# Altium schematic sheet UVLO_MODULE_TOP.SchDoc
size Tabloid; SheetNumber: 2; SheetTotal: 3; Sheet_Name: Top; Size: 11x17
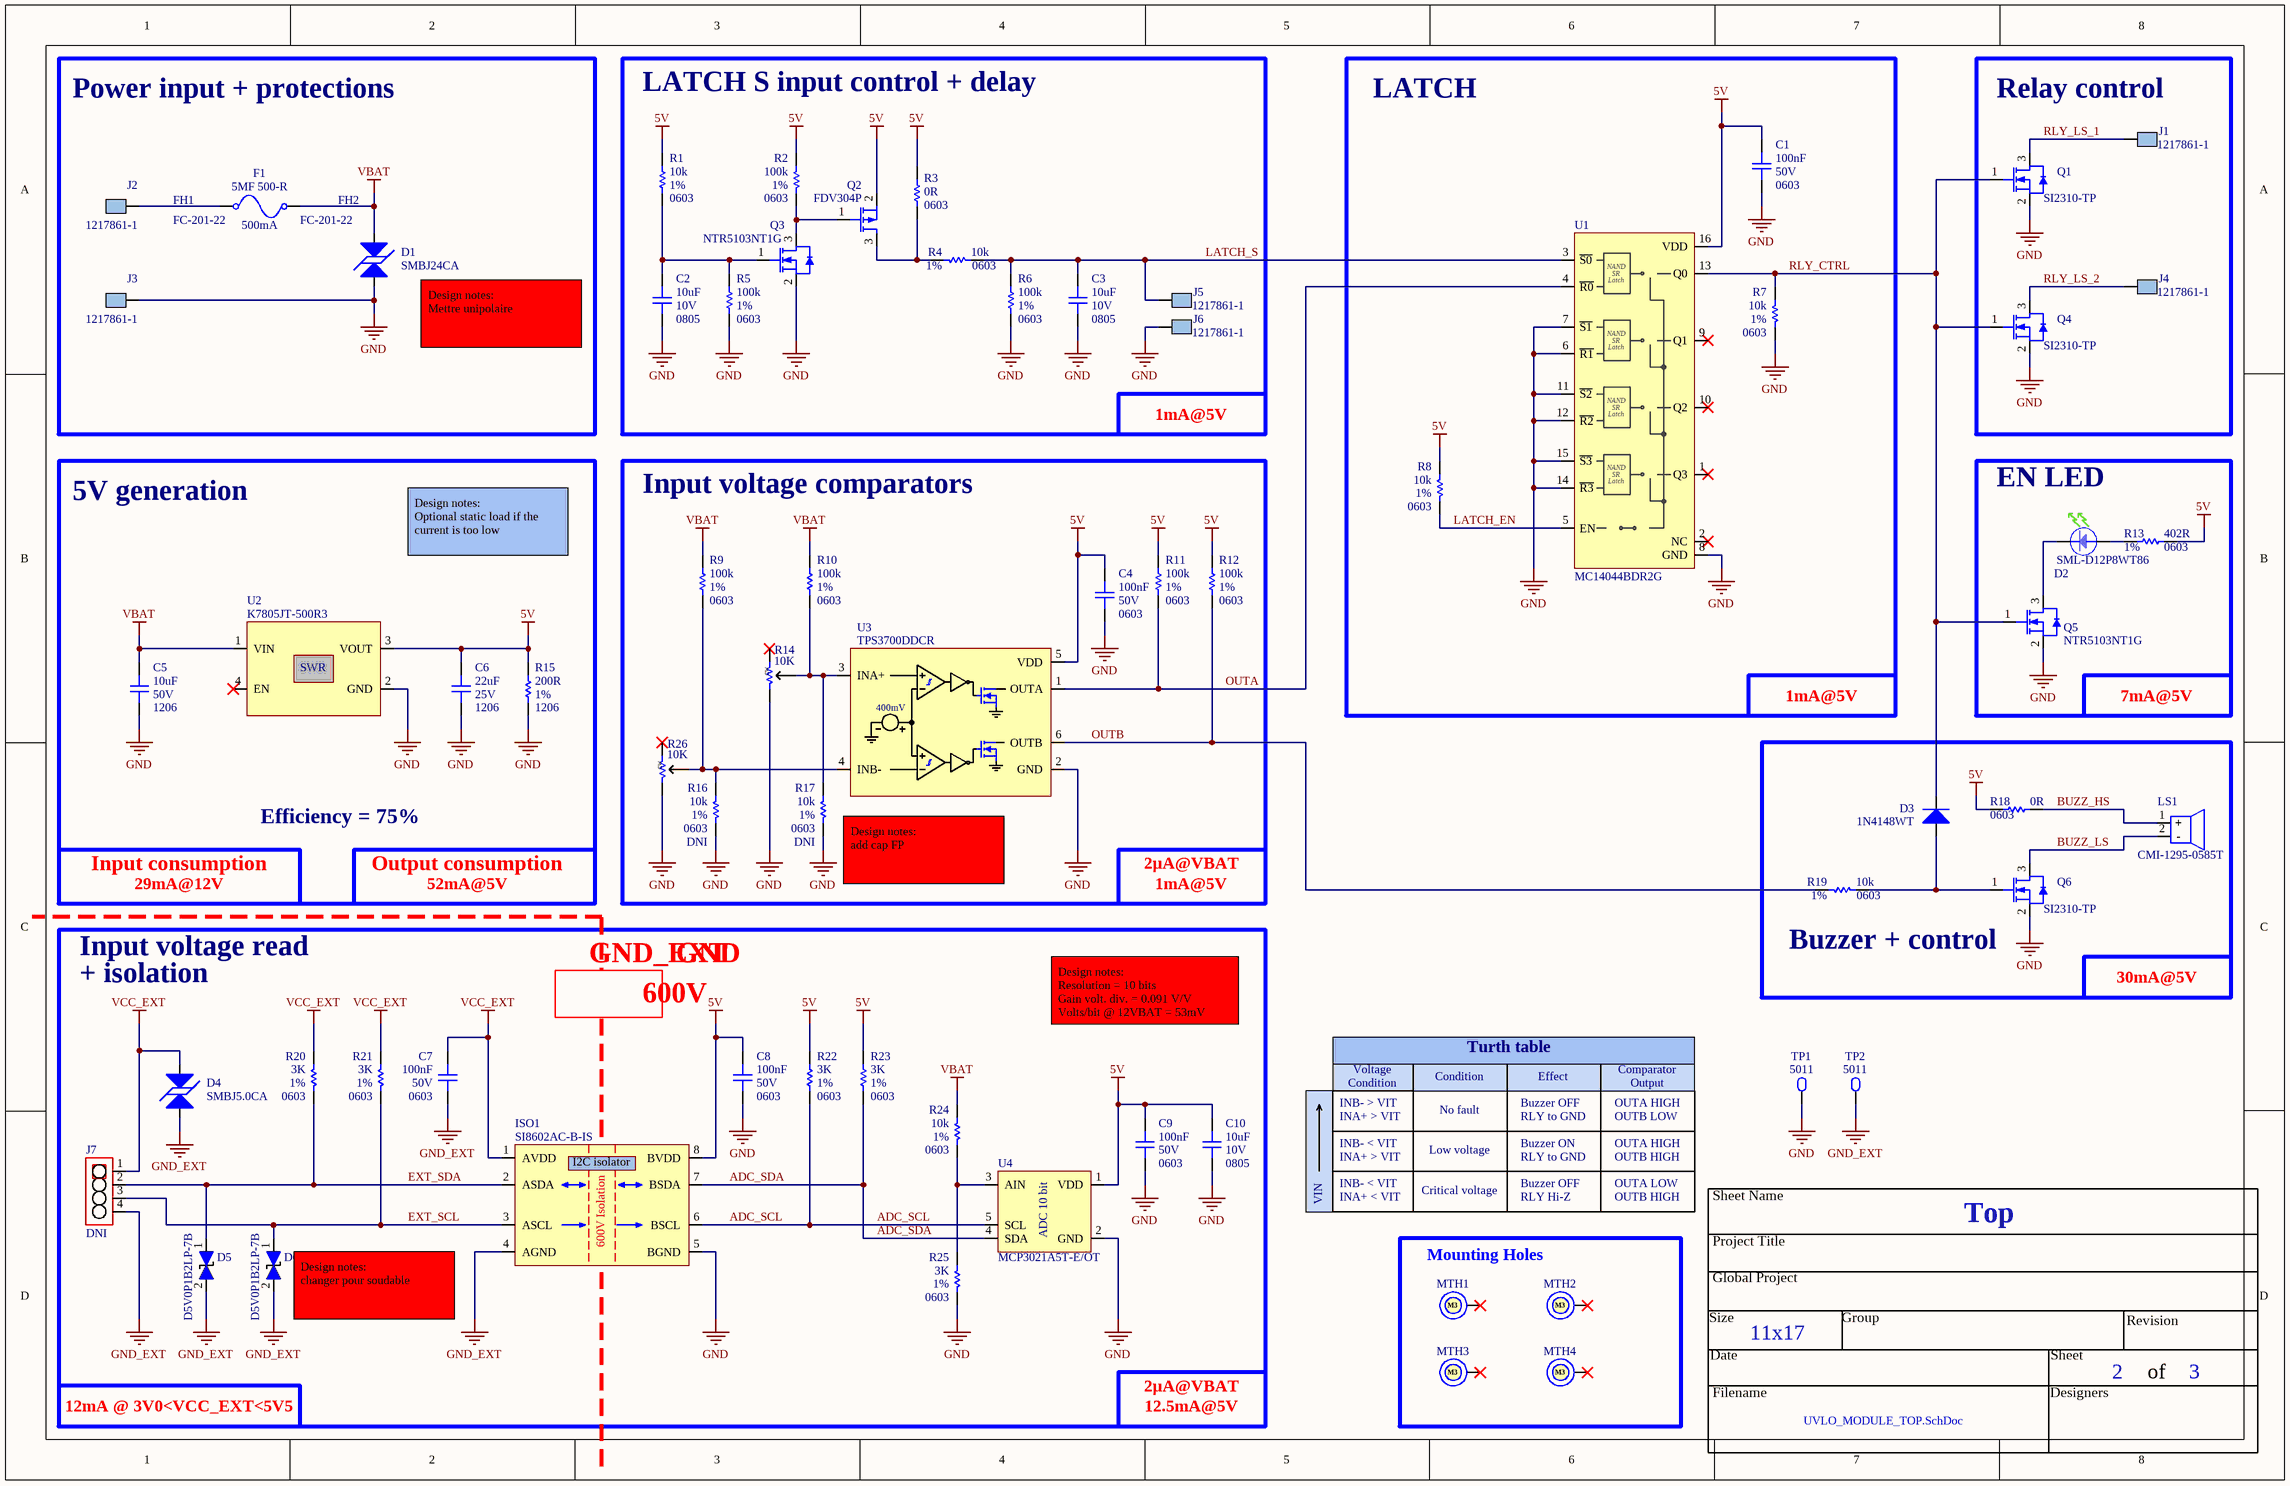
[diagram p0: UVLO_MODULE_TOP.SchDoc]

## Parts
C1  value 100nF  Package: 0603  Voltage Rating: 50V  [CAP_CER_0603]  (hidden comment: CC0603KRX7R9BB104)
C2  value 10uF  Package: 0805  Voltage Rating: 10V  [CAP_CER_0805]  (hidden comment: LMK212BJ106KG-T)
C3  value 10uF  Package: 0805  Voltage Rating: 10V  [CAP_CER_0805]  (hidden comment: LMK212BJ106KG-T)
C4  value 100nF  Package: 0603  Voltage Rating: 50V  [CAP_CER_0603]  (hidden comment: CC0603KRX7R9BB104)
C5  value 10uF  Package: 1206  Voltage Rating: 50V  [CAP_CER_1206]  (hidden comment: GRT31CR61H106KE01L)
C6  value 22uF  Package: 1206  Voltage Rating: 25V  [CAP_CER_1206]  (hidden comment: CL31A226KAHNNNE)
C7  value 100nF  Package: 0603  Voltage Rating: 50V  [CAP_CER_0603]  (hidden comment: CC0603KRX7R9BB104)
C8  value 100nF  Package: 0603  Voltage Rating: 50V  [CAP_CER_0603]  (hidden comment: CC0603KRX7R9BB104)
C9  value 100nF  Package: 0603  Voltage Rating: 50V  [CAP_CER_0603]  (hidden comment: CC0603KRX7R9BB104)
C10  value 10uF  Package: 0805  Voltage Rating: 10V  [CAP_CER_0805]  (hidden comment: LMK212BJ106KG-T)
D1  SMBJ24CA  [TVS_PWR_SMBJ36CA]
D2  SML-D12P8WT86  [LED_SML-D12P8WT86]
D3  1N4148WT  [DIO_1N4148WT]
D4  SMBJ5.0CA  [TVS_PWR_SMBJ5.0CA]
D5  D5V0P1B2LP-7B  [TVS_DATA_D5V0P1B2LP-7B]
D6  D5V0P1B2LP-7B  [TVS_DATA_D5V0P1B2LP-7B]
F1  5MF 500-R  Current Rating: 500mA  [FUS_5MF 500-R]
FH1  FC-201-22  [FHO_FC-201-22]
FH2  FC-201-22  [FHO_FC-201-22]
ISO1  SI8602AC-B-IS  [ISO_SI8602AC-B-IS]
J1  1217861-1  [CON_1217861-1]
J2  1217861-1  [CON_1217861-1]
J3  1217861-1  [CON_1217861-1]
J4  1217861-1  [CON_1217861-1]
J5  1217861-1  [CON_1217861-1]
J6  1217861-1  [CON_1217861-1]
J7  Assembly Note: DNI  [CON_HDR_1X4]  (hidden comment: CON_HDR_1X4)
LS1  CMI-1295-0585T  [UND_SPK_CMI-1295-0585T]
MTH1  M3  [MTH_M3]  (no BOM)
MTH2  M3  [MTH_M3]  (no BOM)
MTH3  M3  [MTH_M3]  (no BOM)
MTH4  M3  [MTH_M3]  (no BOM)
Q1  SI2310-TP  [TRX_NMOS_SI2310-TP]
Q2  FDV304P  [TRX_PMOS_FDV304P]
Q3  NTR5103NT1G  [TRX_NMOS_NTR5103NT1G]
Q4  SI2310-TP  [TRX_NMOS_SI2310-TP]
Q5  NTR5103NT1G  [TRX_NMOS_NTR5103NT1G]
Q6  SI2310-TP  [TRX_NMOS_SI2310-TP]
R1  value 10k  Tolerance: 1%  Package: 0603  [RES_0603]  (hidden comment: RC0603FR-0710KL)
R2  value 100k  Tolerance: 1%  Package: 0603  [RES_0603]  (hidden comment: RC0603FR-07100KL)
R3  value 0R  Package: 0603  [RES_0603]  (hidden comment: RC0603JR-070RL)
R4  value 10k  Tolerance: 1%  Package: 0603  [RES_0603]  (hidden comment: RC0603FR-0710KL)
R5  value 100k  Tolerance: 1%  Package: 0603  [RES_0603]  (hidden comment: RC0603FR-07100KL)
R6  value 100k  Tolerance: 1%  Package: 0603  [RES_0603]  (hidden comment: RC0603FR-07100KL)
R7  value 10k  Tolerance: 1%  Package: 0603  [RES_0603]  (hidden comment: RC0603FR-0710KL)
R8  value 10k  Tolerance: 1%  Package: 0603  [RES_0603]  (hidden comment: RC0603FR-0710KL)
R9  value 100k  Tolerance: 1%  Package: 0603  [RES_0603]  (hidden comment: RC0603FR-07100KL)
R10  value 100k  Tolerance: 1%  Package: 0603  [RES_0603]  (hidden comment: RC0603FR-07100KL)
R11  value 100k  Tolerance: 1%  Package: 0603  [RES_0603]  (hidden comment: RC0603FR-07100KL)
R12  value 100k  Tolerance: 1%  Package: 0603  [RES_0603]  (hidden comment: RC0603FR-07100KL)
R13  value 402R  Tolerance: 1%  Package: 0603  [RES_0603]  (hidden comment: RC0603FR-07402RL)
R14  value 10K  [POT_3362P-1-103LF]  (hidden comment: 3362P-1-103LF)
R15  value 200R  Tolerance: 1%  Package: 1206  [RES_1206]  (hidden comment: CRCW1206200RFKEAC)
R16  value 10k  Assembly Note: DNI  Tolerance: 1%  Package: 0603  [RES_0603]  (hidden comment: RC0603FR-0710KL)
R17  value 10k  Assembly Note: DNI  Tolerance: 1%  Package: 0603  [RES_0603]  (hidden comment: RC0603FR-0710KL)
R18  value 0R  Package: 0603  [RES_0603]  (hidden comment: RC0603JR-070RL)
R19  value 10k  Tolerance: 1%  Package: 0603  [RES_0603]  (hidden comment: RC0603FR-0710KL)
R20  value 3K  Tolerance: 1%  Package: 0603  [RES_0603]  (hidden comment: RC0603FR-073KL)
R21  value 3K  Tolerance: 1%  Package: 0603  [RES_0603]  (hidden comment: RC0603FR-073KL)
R22  value 3K  Tolerance: 1%  Package: 0603  [RES_0603]  (hidden comment: RC0603FR-073KL)
R23  value 3K  Tolerance: 1%  Package: 0603  [RES_0603]  (hidden comment: RC0603FR-073KL)
R24  value 10k  Tolerance: 1%  Package: 0603  [RES_0603]  (hidden comment: RC0603FR-0710KL)
R25  value 3K  Tolerance: 1%  Package: 0603  [RES_0603]  (hidden comment: RC0603FR-073KL)
R26  value 10K  [POT_3362P-1-103LF]  (hidden comment: 3362P-1-103LF)
TP1  5011  [TPO_5011]
TP2  5011  [TPO_5011]
U1  MC14044BDR2G  [LOG_LATCH_MC14044BDR2G]
U2  K7805JT-500R3  [REG_SWR_K7805JT-500R3]
U3  TPS3700DDCR  [CMP_TPS3700DDCR]
U4  MCP3021A5T-E/OT  [ADC_MCP3021A5T-E/OT]

## Blocks framed on the sheet
Power input + protections: D1 F1 FH1 FH2 J2 J3
LATCH S input control + delay: C2 C3 J5 J6 Q2 Q3 R1-R6
LATCH: C1 R7 R8 U1
Relay control: J1 J4 Q1 Q4
5V generation: C5 C6 R15 U2
Input voltage comparators: C4 R9-R12 R14 R16 R17 R26 U3
EN LED: D2 Q5 R13
Buzzer + control: D3 LS1 Q6 R18 R19
Mounting Holes: MTH1-MTH4

## Nets
5V: C1.2 C4.2 C6.2 C8.2 C9.2 C10.2 ISO1.8(BVDD) Q2.2(S) R1.2 R2.2 R3.2 R8.2 R11.2 R12.2 R13.1 R15.2 R18.2 R22.2 R23.2 U1.16(VDD) U2.3(VOUT) U3.5(VDD) U4.1(VDD)
GND: C1.1 C2.1 C3.1 C4.1 C5.1 C6.1 C8.1 C9.1 C10.1 D1.2 ISO1.5(BGND) J3.1 J6.1 Q1.2(S) Q3.2(S) Q4.2(S) Q5.2(S) Q6.2(S) R5.1 R6.1 R7.1 R14.1 R15.1 R16.1 R17.1 R25.1 R26.1 TP1.1 U1.6(~{R1}) U1.7(~{S1}) U1.8(GND) U1.11(~{S2}) U1.12(~{R2}) U1.14(~{R3}) U1.15(~{S3}) U2.2(GND) U3.2(GND) U4.2(GND)
GND_EXT: C7.1 D4.2 D5.2(i/o) D6.2(i/o) ISO1.4(AGND) J7.4 TP2.1
VBAT: C5.2 D1.1 FH2.1 R9.2 R10.2 R24.2 U2.1(VIN)
VCC_EXT: C7.2 D4.1 ISO1.1(AVDD) J7.1 R20.2 R21.2
ADC_SCL: ISO1.6(BSCL) R22.1 U4.5(SCL)
ADC_SDA: ISO1.7(BSDA) R23.1 U4.4(SDA)
BUZZ_HS: LS1.1(+) R18.1
BUZZ_LS: LS1.2(-) Q6.3(D)
EXT_SCL: D6.1(i/o) ISO1.3(ASCL) J7.3 R21.1
EXT_SDA: D5.1(i/o) ISO1.2(ASDA) J7.2 R20.1
LATCH_EN: R8.1 U1.5(EN)
LATCH_S: C3.2 J5.1 R4.1 R6.2 U1.3(~{S0})
OUTA: R11.1 U1.4(~{R0}) U3.1(OUTA)
OUTB: R12.1 R19.2 U3.6(OUTB)
RLY_CTRL: D3.K Q1.1(G) Q4.1(G) Q5.1(G) R7.2 U1.13(Q0)
RLY_LS_1: J1.1 Q1.3(D)
RLY_LS_2: J4.1 Q4.3(D)
NetC2_2: C2.2 Q3.1(G) R1.1 R5.2
NetD2_A: D2.A R13.2
NetD2_K: D2.K Q5.3(D)
NetD3_A: D3.A Q6.1(G) R19.1
NetFH1_1: FH1.1 J2.1
NetQ2_1: Q2.1(G) Q3.3(D) R2.1
NetQ2_3: Q2.3(D) R3.1 R4.2
NetR9_1: R9.1 R16.2 R26.2 U3.4(INB-)
NetR10_1: R10.1 R14.2 R17.2 U3.3(INA+)
NetR24_1: R24.1 R25.2 U4.3(AIN)

Not connected (* = marked no-connect by the designer): MTH1 1*; MTH2 1*; MTH3 1*; MTH4 1*; R14 3*; R26 3*; U1 1(Q3)* 2(NC)* 9(Q1)* 10(Q2)*; U2 4(EN)*

## Notes on the sheet
- (near D1) Design notes:
  Mettre unipolaire
- 1mA@5V
- Design notes:
  Optional static load if the current is too low
- 7mA@5V
- Efficiency = 75%
- 29mA@12V
- Input consumption
- 52mA@5V
- Output consumption
- (near R17) Design notes:
  add cap FP
- 2µA@VBAT
- Input voltage read
- GND_EXT
- GND
- 30mA@5V
- + isolation
- 600V
- Design notes:
  Resolution = 10 bits
  Gain volt. div. = 0.091 V/V
  Volts/bit @ 12VBAT = 53mV
- INB- > VIT
- Voltage
- Condition
- Turth table
- Buzzer OFF
- Effect
- OUTA HIGH
- Comparator
- Output
- INB- < VIT
- INA+ > VIT
- No fault
- Low voltage
- Buzzer ON
- RLY to GND
- OUTB LOW
- OUTB HIGH
- VIN
- INA+ < VIT
- Critical voltage
- RLY Hi-Z
- OUTA LOW
- (near D6) Design notes:
  changer pour soudable
- 12mA @ 3V0<VCC_EXT<5V5
- 12.5mA@5V
- Sheet Name
- Project Title
- Global Project
- Revision
- Size
- Date
- Group
- Sheet
- of
- Filename
- Designers
- (in symbol ADC_MCP3021A5T-E/OT) ADC 10 bit
- (in symbol CMP_TPS3700DDCR) 400mV
- (in symbol ISO_SI8602AC-B-IS) I2C isolator
- (in symbol LOG_LATCH_MC14044BDR2G) NAND; SR; Latch
- (in symbol POT_3362P-1-103LF) CW
- (in symbol REG_SWR_K7805JT-500R3) SWR

## Library data of the parts
C1 C4 C7-C9 = CAP_CER_CC0603KRX7R9BB104: CAP - CER 100nF 50V X7R - 0603; Manufacturer #1: Yageo; Tolerance: 10%; GRAMS Lib Spec: 2.8; Magnetic Material: UNKNOWN; Polarized: NO; Current Rating: *; Power Max: *; HelpURL: https://www.yageo.com/upload/media/product/productsearch/datasheet/mlcc/UPY-GPHC_X7R_6.3V-to-50V_18.pdf; CreatedBy/Date: Louis-Daniel Gaulin / 25-02-2021; VerifiedBy: Hubert Dube - 26/02/2021; Temperature: -55°C ~ 125°C; Manufacturer #2: *; Note: *; Assembly Type: SMD; Part Number #2: *; Part Number #1: CC0603KRX7R9BB104; Supplier 1: Digi-Key; Supplier Part Number 1: 311-1344-1-ND; Cryo: UNKNOWN
C2 C3 C10 = CAP_CER_LMK212BJ106KG-T: CAP - CER 10UF 10% 10V X5R - 0805; Manufacturer #1: Taiyo Yuden; GRAMS Lib Spec: 2.8; Magnetic Material: Unknown; Polarized: NO; Assembly Type: SMD; CreatedBy/Date: Caroline Paulin / 25 juillet 2018; Current Rating: *; HelpURL: https://www.yuden.co.jp/productdata/catalog/mlcc_all_e.pdf; Manufacturer #2: *; Note: *; Part Number #1: LMK212BJ106KG-T; Part Number #2: *; Power Max: *; Temperature: -55°C ~ 85°C; Tolerance: 10%; VerifiedBy: Nicolas V. (2019-01-22); Supplier 1: Digi-Key; Supplier Part Number 1: 587-1300-1-ND; Cryo: UNKNOWN
C5 = CAP_CER_GRT31CR61H106KE01L: CAP - CER 10UF 10% 50V X5R - 1206; Manufacturer #1: Murata Electronics North America; GRAMS Lib Spec: 2.8; Magnetic Material: Unknown; Polarized: No; Tolerance: 10%; Current Rating: *; Power Max: *; HelpURL: https://search.murata.co.jp/Ceramy/image/img/A01X/G101/ENG/GRT31CR61H106KE01-01.pdf; CreatedBy/Date: Nicolas Roy - 2018/12/19; VerifiedBy: Nicolas V. (2019-01-22); Temperature: -55°C ~ 85°C; Manufacturer #2: *; Note: *; Assembly Type: SMD; Part Number #2: *; Part Number #1: GRT31CR61H106KE01L; Supplier 1: Digi-Key; Supplier Part Number 1: 490-12456-1-ND; Cryo: UNKNOWN
C6 = CAP_CER_CL31A226KAHNNNE: CAP - CER 22uF 10% 25V X5R - 1206; Manufacturer #1: Samsung Electro-Mechanics; GRAMS Lib Spec: 2.8; Magnetic Material: Unknown; Polarized: NO; Assembly Type: SMD; CreatedBy/Date: Philippe Arsenault/21 Janvier 2020; Current Rating: *; HelpURL: http://www.samsungsem.com/global/support/product-search/mlcc/1207445_4880.html; Manufacturer #2: *; Note: *; Part Number #1: CL31A226KAHNNNE; Part Number #2: 1276-3047-1-ND; Power Max: *; Temperature: -55°C ~ 85°C; Tolerance: 10%; VerifiedBy: C.Paulin - 28/01/2020; Supplier 1: Digi-Key; Supplier Part Number 1: 1276-3047-1-ND; Cryo: UNKNOWN
D1 = TVS_PWR_SMBJ24CA: TVS - 24V 26.7V 600W - DO214AA; Manufacturer #1: Littelfuse Inc.; Value: Vbr = 26.7V -  Clamp = 38.9V; Voltage Rating: 24V Standoff; Current Rating: 15.5A; GRAMS Lib Spec: 2.8; Magnetic Material: UNKNOWN; Polarized: NO; Tolerance: *; Power Max: 600W; HelpURL: http://www.littelfuse.com/~/media/electronics/datasheets/tvs_diodes/littelfuse_tvs_diode_smbj_datasheet.pdf.pdf; CreatedBy/Date: Arnaud Samson - 06/07/18; VerifiedBy: Jonathan Bouchard - 2018-07-13; Temperature: -65°C ~ 150°C (TJ); Package: DO214AA; Manufacturer #2: *; Note: *; Assembly Type: SMD; Part Number #2: *; Part Number #1: SMBJ24CA; Supplier 1: Digi-Key; Supplier Part Number 1: SMBJ24CALFCT-ND; Cryo: UNKNOWN
D2 = LED_SML-D12P8WT86: LED - GREEN DIFFUSED 0603 SMD - 0603; Manufacturer #1: Rohm Semiconductor; Current Rating: 1-20mA; Note: Operate at 2mA; Value: 560 nm (green); Voltage rating: 2.2V (Forward), 5V (max Reverse); Polarized: Yes; Magnetic Material: Unknown; GRAMS Lib Spec: 2.8; Manufacturer #2: *; Power Max: *; Part Number #1: SML-D12P8WT86; Part Number #2: *; HelpURL: https://d1d2qsbl8m0m72.cloudfront.net/en/products/databook/datasheet/opto/led/chip_mono/sml-d12x8_d13x8-e.pdf; Supplier 1: Digi-Key; Supplier Part Number 1: 511-1579-2-ND; Assembly Type: SMD; Temperature: -40 ~ 85 °C; Package: 0603; CreatedBy/Date: Keven Deslandes - 2018/11/21; Tolerance: *; VerifiedBy: Caroline Paulin - 13 février 2019; Cryo: UNKNOWN
D3 = DIO_1N4148WT: DIO - 1N4148WT - SOD-523F; Manufacturer #1: On Semiconductor; Current Rating: 200mA; GRAMS Lib Spec: 2.8; Magnetic Material: UNKNOWN; Polarized: Yes; Power Max: 200mW; Value: 1V @ 10mA; Voltage Rating: 75V; Assembly Type: SMD; CreatedBy/Date: Joel Lemay 2018-06-15; HelpURL: https://www.fairchildsemi.com/datasheets/1N/1N914BWT.pdf; Manufacturer #2: *; Note: *; Package: SOD-523F; Part Number #1: 1N4148WT; Part Number #2: *; Supplier 1: Digi-Key; Supplier Part Number 1: 1N4148WTCT-ND; Temperature: -55°C ~ 150°C; Tolerance: *; VerifiedBy: Arnaud Samson 17-07-18; Cryo: UNKNOWN
D4 = TVS_PWR_SMBJ5.0CA: TVS - BIDIR 5V 9.2V 600W - DO214AA; Manufacturer #1: Littelfuse Inc.; Value: Vbr = 6.4V -  Clamp = 9.2V; Voltage Rating: 5V Standoff; Current Rating: 65.3 A (Ipp); Power Max: 600W (Pppm); GRAMS Lib Spec: 2.8; Magnetic Material: UNKNOWN; Polarized: NO; Tolerance: *; HelpURL: http://www.littelfuse.com/~/media/electronics/datasheets/tvs_diodes/littelfuse_tvs_diode_smbj_datasheet.pdf.pdf; CreatedBy/Date: Jonathan Bouchard - 2019-03-22; VerifiedBy: Nicolas V. (2019-05-06); Temperature: -65°C ~ 150°C (TJ); Package: DO214AA; Manufacturer #2: *; Note: *; Assembly Type: SMD; Part Number #2: *; Part Number #1: SMBJ5.0CA; Supplier 1: Digi-Key; Supplier Part Number 1: SMBJ5.0CALFCT-ND; Cryo: UNKNOWN
D5 D6 = TVS_DATA_D5V0P1B2LP-7B: TVS - TVS DIODE 5.5V 13V - 0402; Manufacturer #1: Diodes Incorporated; Current Rating: 4Apeak; Power Max: 250mW; GRAMS Lib Spec: 2.8; Magnetic Material: Unknown; Polarized: Yes; Value: *; Tolerance: *; Voltage Rating: 5.5V; HelpURL: https://www.diodes.com/assets/Datasheets/D5V0P1B2LP.pdf; CreatedBy/Date: Keven Deslandes - 2018/10/19; VerifiedBy: Caroline Paulin -28 janvier 2018; Temperature: -65°C ~ 150°C (TJ); Package: 0402; Manufacturer #2: *; Note: *; Assembly Type: SMD; Part Number #2: *; Part Number #1: D5V0P1B2LP-7B; Supplier 1: Digi-Key; Supplier Part Number 1: D5V0P1B2LP-7BDICT-ND; Cryo: UNKNOWN
F1 = FUS_5MF 500-R: FUS - CARTRIDGE GLASS 500mA 250VAC/125VDC - 5X20mm; Manufacturer #1: Bel Fuse Inc.; Value: 500mA, Fast blow; GRAMS Lib Spec: 2.8c; Note: Use with 2x FC-201-22 clip; Magnetic Material: UNKNOWN; Polarized: NO; Rule: UNIONINDEX=0|RULEKIND=ComponentClearance|NETSCOPE=AnyNet|LAYERKIND=SameLayer|NAME=Schematic Component Clearance Constraint|GAP=0mil|COLLISIONCHECKMODE=3|VERTICALGAP=0mil|SHOWDISTANCES=FALSE|UNIT=Imperial; Tolerance: *; Power Max: *; HelpURL: https://belfuse.com/resources/datasheets/circuitprotection/ds-cp-5mf-5mfp-series.pdf; CreatedBy/Date: Louis-Daniel Gaulin; VerifiedBy: Hubert Dube - 26/02/2021; Temperature: -55°C ~ 125°C; Package: 3AB; Manufacturer #2: *; Assembly Type: MANUAL; Part Number #2: *; Part Number #1: 5MF 500-R; Supplier 1: Digi-Key; Supplier Part Number 1: 507-1259-ND; Voltage Rating: 250VAC/125VDC; Cryo: UNKNOWN
FH1 FH2 = FHO_FC-201-22: FHO - FUSE CLIP 5mm CARTRIDGE 10A PCB - 2-TH; Manufacturer #1: Bel Fuse Inc.; Value: for 5mm diameter fuses; GRAMS Lib Spec: 2.8; Magnetic Material: UNKNOWN; Polarized: Yes; Tolerance: *; Power Max: *; HelpURL: https://belfuse.com/resources/datasheets/circuitprotection/ds-cp-0672-fuse-clips-series.pdf; CreatedBy/Date: Louis-Daniel Gaulin / 26-02-2021; VerifiedBy: Hubert Dube - 26/02/2021; Temperature: *; Package: 2-TH; Manufacturer #2: *; Note: *; Assembly Type: TH; Part Number #2: *; Part Number #1: FC-201-22; Supplier 1: Digi-Key; Supplier Part Number 1: FC-201-22-ND; Voltage Rating: *; Current Rating: 10A; Cryo: UNKNOWN
ISO1 = ISO_SI8602AC-B-IS: ISO - DGTL ISO 600V 2CH I2C  - 8-SOIC; Manufacturer #1: Silicon Labs; Polarized: YES; Magnetic Material: UNKNOWN; Value: 600V Isolation; GRAMS Lib Spec: 2.8; Voltage Rating: 3 V ~ 5.5 V; Current Rating: *; Manufacturer #2: *; Power Max: *; Part Number #1: SI8602AC-B-IS; Part Number #2: *; HelpURL: https://www.silabs.com/documents/public/data-sheets/Si860x.pdf; Note: *; Supplier 1: Digi-Key; Supplier Part Number 1: 336-2050-5-ND; Assembly Type: SMD; Package: 8-SOIC; Temperature: -40°C ~ 125°C; CreatedBy/Date: Louis-Daniel Gaulin / 25-02-2021; Tolerance: *; VerifiedBy: Hubert Dube - 26/02/2021; Cryo: UNKNOWN
J1-J6 = CON_1217861-1: CON - Quick connect tab - TH; Manufacturer #1: TE Connectivity AMP Connectors; Value: 250 mills; GRAMS Lib Spec: 2.8; Magnetic Material: Unknown; Polarized: Yes; Tolerance: -; Voltage Rating: *; Current Rating: -; Power Max: -; HelpURL: https://www.te.com/commerce/DocumentDelivery/DDEController?Action=srchrtrv&DocNm=1217861&DocType=Customer+Drawing&DocLang=English; CreatedBy/Date: Louis-Daniel Gaulin / 24-02-2021; VerifiedBy: Hubert Dube - 26/02/2021; Temperature: -; Package: TH; Manufacturer #2: -; Assembly Type: TH; Part Number #2: -; Part Number #1: 1217861-1; Supplier 1: Digi-Key; Supplier Part Number 1: A100452CT-ND; Cryo: UNKNOWN
J7 = CON_HDR_1X4: CON - Header 1X4 pins, 100Mils - TH-4; Polarized: No; Magnetic Material: UNKNOWN; GRAMS Lib Spec: 2.8; Manufacturer #1: *; Current Rating: *; Power Max: *; Voltage Rating: *; Manufacturer #2: *; Note: *; Part Number #2: *; HelpURL: *; Package: TH-4; Assembly Type: TH; Temperature: *; CreatedBy/Date: Nicolas V (2020-02-24); Tolerance: *; VerifiedBy: Nicolas V (2020-02-24); Cryo: UNKNOWN
LS1 = UND_LS_CMI-1295-0585T: LS - Buzzer indicator 5V 30mA 2.3kHz 85dB - TH; Manufacturer #1: CUI Devices; Value: 85dB @ 5V, 10cm; Voltage Rating: 4 ~ 7V; GRAMS Lib Spec: 2.8; Magnetic Material: Unknown; Polarized: Yes; Tolerance: -; Current Rating: 30 mA; Power Max: -; HelpURL: https://www.cuidevices.com/product/resource/cmi-1295-0585t.pdf; CreatedBy/Date: Louis-Daniel Gaulin / 24-02-2021; VerifiedBy: Hubert Dube - 26/02/2021; Temperature: -40°C ~ 85°C; Package: TH; Manufacturer #2: -; Assembly Type: TH; Part Number #2: -; Part Number #1: CMI-1295-0585T; Supplier 1: Digi-Key; Supplier Part Number 1: 102-CMI-1295-0585T-ND; Cryo: UNKNOWN
MTH1-MTH4 = MTH_M3: MTH - MOUNTING HOLE M3 PLATED - M3; GRAMS Lib Spec: 2.8; Magnetic Material: NO; Cryo: UNKNOWN; Value: *; Tolerance: *; Voltage Rating: *; Current Rating: *; Power Max: *; HelpURL: https://littlemachineshop.com/images/gallery/PDF/TapDrillSizes.pdf; CreatedBy/Date: Jonathan Bouchard 2018-07-23; VerifiedBy: Arnaud Samson 23-07-18; Temperature: *; Package: M3; Manufacturer #1: *; Manufacturer #2: *; Note: *; Assembly Type: NONE; Part Number #2: *; Part Number #1: *; Polarized: *; Supplier 1: *; Supplier Part Number 1: *
Q1 Q4 Q6 = TRX_NMOS_SI2310-TP: TRX - MOSFET N-CH 60V 3A - SOT-23; Manufacturer #1: Micro Commercial Co; Power Max: 350mW; Voltage rating: 60V (Vds max), 2V (Vgs @ 250uA); Polarized: Yes; Magnetic Material: UNKNOWN; GRAMS Lib Spec: 2.8c; Current Rating: 3A; Manufacturer #2: *; Value: *; Part Number #1: SI2310-TP; Part Number #2: *; HelpURL: https://www.mccsemi.com/pdf/Products/SI2310(SOT-23)-A.pdf; Supplier 1: Digi-Key; Supplier Part Number 1: SI2310-TPMSCT-ND; Assembly Type: SMD; Temperature: -55°C ~ 150°C (TJ); Package: SOT-23; CreatedBy/Date: Louis-Daniel Gaulin / 20-02-2020; Tolerance: *; VerifiedBy: C.Paulin - 21/02/2020; Cryo: UNKNOWN
Q2 = TRX_PMOS_FDV304P: TRX - PMOS 25V 460MA - SOT−23; Manufacturer #1: ON Semiconductor; GRAMS Lib Spec: 2.8; Magnetic Material: Unknown; Polarized: Yes; Power Max: 350mW; Assembly Type: SMD; CreatedBy/Date: Joel Lemay 2018-07-20; Current Rating: 460mA; HelpURL: https://media.digikey.com/pdf/Data%20Sheets/Fairchild%20PDFs/FDV304P.pdf; Manufacturer #2: *; Package: SOT-23; Part Number #1: FDV304P; Part Number #2: *; Supplier 1: Digi-Key; Supplier Part Number 1: FDV304PCT-ND; Temperature: -55°C ~ 150°C; Tolerance: *; Value: *; VerifiedBy: Caroline Paulin - 6 sept 2018; Voltage Rating: 25V; Cryo: UNKNOWN
Q3 Q5 = TRX_NMOS_NTR5103NT1G: TRX - MOSFET N-CH 60V 0.26A- SOT-23-3; Manufacturer #1: ON Semiconductor; Current Rating: 260mA (Id); Power Max: 300mW; Voltage rating: 60V (Vds max), 2.6V (Vgs @ 250uA); Polarized: Yes; Magnetic Material: UNKNOWN; GRAMS Lib Spec: 2.8; Manufacturer #2: *; Value: *; Part Number #1: NTR5103NT1G; Part Number #2: *; HelpURL: http://www.onsemi.com/pub/Collateral/NTR5103N-D.PDF; Supplier 1: Digi-Key; Supplier Part Number 1: NTR5103NT1GOSCT-ND; Assembly Type: SMD; Temperature: -55°C ~ 150°C (TJ); Package: SOT-23-3; CreatedBy/Date: Olivier Bernard / 7/5/2017; Tolerance: *; VerifiedBy: Caroline Paulin / 10 juillet 2018; Cryo: UNKNOWN
R1 R4 R7 R8 R16 R17 R19 R24 = RES_RC0603FR-0710KL: RES - 10k 1% 1/10W - 0603; Manufacturer #1: Yageo; GRAMS Lib Spec: 2.8; Magnetic Material: Unknown; Polarized: No; Voltage Rating: 75V; Assembly Type: SMD; CreatedBy/Date: Louis-Daniel Gaulin / 24-02-2021; Current Rating: *; HelpURL: https://www.yageo.com/upload/media/product/productsearch/datasheet/rchip/PYu-RC_Group_51_RoHS_L_11.pdf; Manufacturer #2: *; Note: *; Part Number #1: RC0603FR-0710KL; Part Number #2: *; Power Max: 1/10W; Temperature: -55°C ~ 155°C; VerifiedBy: Hubert Dube - 26/02/2021; Supplier 1: Digi-Key; Supplier Part Number 1: 311-10.0KHRCT-ND
R2 R5 R6 R9-R12 = RES_RC0603FR-07100KL: RES - 100k 1% 1/10W - 0603; Manufacturer #1: Yageo; GRAMS Lib Spec: 2.8; Magnetic Material: Unknown; Polarized: No; Voltage Rating: 75V; Assembly Type: SMD; CreatedBy/Date: Louis-Daniel Gaulin / 24-02-2021; Current Rating: *; HelpURL: https://www.yageo.com/upload/media/product/productsearch/datasheet/rchip/PYu-RC_Group_51_RoHS_L_11.pdf; Manufacturer #2: *; Note: *; Part Number #1: RC0603FR-07100KL; Part Number #2: *; Power Max: 1/10W; Temperature: -55°C ~ 155°C; VerifiedBy: Hubert Dube; Supplier 1: Digi-Key; Supplier Part Number 1: 311-100KHRCT-ND
R3 R18 = RES_RC0603JR-070RL: RES - 0 ohm jumper 1/10W - 0603; Manufacturer #1: Yageo; GRAMS Lib Spec: 2.8; Magnetic Material: Unknown; Polarized: No; Assembly Type: SMD; CreatedBy/Date: L-P Gauthier 2018-10-30; Current Rating: *; HelpURL: http://www.yageo.com/documents/recent/PYu-RC_Group_51_RoHS_L_9.pdf; Manufacturer #2: *; Part Number #1: RC0603JR-070RL; Part Number #2: *; Power Max: 1/10W; Temperature: -55°C ~ 155°C; VerifiedBy: Caroline Paulin  - 5/11/2018; Voltage Rating: -; Supplier 1: Digi-Key; Supplier Part Number 1: 311-0.0GRCT-ND; Cryo: UNKNOWN
R13 = RES_RC0603FR-07402RL: RES - 402R 1% 1/10W - 0603; Manufacturer #1: Yageo; GRAMS Lib Spec: 2.8; Magnetic Material: Unknown; Polarized: No; Voltage Rating: 75V; Assembly Type: SMD; CreatedBy/Date: Louis-Daniel Gaulin / 24-02-2021; Current Rating: *; HelpURL: https://www.yageo.com/upload/media/product/productsearch/datasheet/rchip/PYu-RC_Group_51_RoHS_L_11.pdf; Manufacturer #2: *; Note: *; Part Number #1: RC0603FR-07402RL; Part Number #2: *; Power Max: 1/10W; Temperature: -55°C ~ 155°C; VerifiedBy: Hubert Dube - 26/02/2021; Supplier 1: Digi-Key; Supplier Part Number 1: 311-402HRCT-ND
R14 R26 = POT_3362P-1-103LF: RES -  POT 10K 1/2W LINEAR PLASTIC 1 turn - TH; Manufacturer #1: Bourns Inc.; GRAMS Lib Spec: 2.8; Tolerance: 10%; Magnetic Material: Unknown; Polarized: YES; Voltage Rating: 500V; Assembly Type: TH; CreatedBy/Date: Louis-Daniel Gaulin / 24-02-2021; Current Rating: *; HelpURL: https://www.bourns.com/docs/Product-Datasheets/3362.pdf; Manufacturer #2: *; Note: *; Part Number #1: 3362P-1-103LF; Part Number #2: *; Power Max: 1/2W; Temperature: *; VerifiedBy: Hubert Dube - 26/02/2021; Supplier 1: Digi-Key; Supplier Part Number 1: 3362P-103LF-ND; Package: TH; Cryo: UNKNOWN
R15 = RES_CRCW1206200RFKEAC: RES - 200R 1% 1/4W - 1206; Manufacturer #1: Vishay Dale; GRAMS Lib Spec: 2.8; Magnetic Material: Unknown; Polarized: No; Voltage Rating: 75V; Assembly Type: SMD; CreatedBy/Date: Louis-Daniel Gaulin / 26-02-2021; Current Rating: *; HelpURL: https://www.vishay.com/docs/28773/crcwce3.pdf; Manufacturer #2: *; Note: *; Part Number #1: CRCW1206200RFKEAC; Part Number #2: *; Power Max: 1/4W; Temperature: -55°C ~ 155°C; VerifiedBy: Hubert Dubé/ 26-02-2021; Supplier 1: Digi-Key; Supplier Part Number 1: 541-4176-1-ND
R20-R23 R25 = RES_RC0603FR-073KL: RES - 3k 1% 1/10W - 0603; Manufacturer #1: Yageo; GRAMS Lib Spec: 2.8; Magnetic Material: Unknown; Polarized: No; Voltage Rating: 75V; Assembly Type: SMD; CreatedBy/Date: Louis-Daniel Gaulin / 24-02-2021; Current Rating: *; HelpURL: https://www.yageo.com/upload/media/product/productsearch/datasheet/rchip/PYu-RC_Group_51_RoHS_L_11.pdf; Manufacturer #2: *; Note: *; Part Number #1: RC0603FR-073KL; Part Number #2: *; Power Max: 1/10W; Temperature: -55°C ~ 155°C; VerifiedBy: Hubert Dube - 26/02/2021; Supplier 1: Digi-Key; Supplier Part Number 1: 311-3.00KHRCT-ND
TP1 TP2 = TPO_5011: TPO - TEST POINT - TH; Manufacturer #1: Keystone Electronics; Polarized: No; Magnetic Material: UNKNOWN; GRAMS Lib Spec: 2.8; Current Rating: *; Manufacturer #2: *; Note: *; Power Max: *; Value: *; Part Number #1: 5011; Part Number #2: *; HelpURL: https://www.keyelco.com/userAssets/file/M65p56.pdf; Assembly Type: TH; Package: *; CreatedBy/Date: Louis-Daniel Gauli / 02-11-2020; Temperature: *; Tolerance: *; VerifiedBy: Philippe Arsenault/2020-11-06; Voltage Rating: *; Cryo: UNKNOWN; Supplier 1: Digi-Key; Supplier Part Number 1: 36-5011-ND
U1 = LOG_LATCH_MC14044BDR2G: LOG - Quad S-R Latch w/ Output Enable - 16-SOIC; Manufacturer #1: ON Semiconductor; Voltage Rating: 3V~18V; Current Rating: 8.8mA; GRAMS Lib Spec: 2.8; Magnetic Material: Unknown; Polarized: Yes; Value: *; Tolerance: *; Power Max: *; HelpURL: https://www.onsemi.com/pub/Collateral/MC14043B-D.PDF; CreatedBy/Date: Louis-Daniel Gaulin / 24-02-2021; VerifiedBy: Hubert Dube - 26/02/2021; Temperature: -55°C ~ 125°C; Package: 16-SOIC; Manufacturer #2: *; Assembly Type: SMD; Part Number #2: *; Part Number #1: MC14044BDR2G; Supplier 1: Digi-Key; Supplier Part Number 1: MC14044BDR2GOSCT-ND; Cryo: UNKNOWN
U2 = REG_SWR_K7805JT-500R3: REG_DC DC CONVERTER 5V 2.5W - 4-SMD Module; Manufacturer #1: Mornsun America, LLC; Voltage Rating: 6.5V to 36V IN; Current Rating: 0.5A; GRAMS Lib Spec: 2.8; Magnetic Material: Unknown; Polarized: Yes; Value: 5V; Tolerance: *; Power Max: *; HelpURL: https://www.mornsun-power.com/html/pdf/K7805JT-500R3.html; CreatedBy/Date: Louis-Daniel Gaulin / 25-02-2021; VerifiedBy: Hubert Dube - 26/02/2021; Temperature: -40°C ~ 85°C; Package: 4-SMD Module; Manufacturer #2: *; Note: *; Assembly Type: SMD; Part Number #2: *; Part Number #1: K7805JT-500R3; Supplier 1: Digi-Key; Supplier Part Number 1: 2725-K7805JT-500R3CT-ND; Cryo: UNKNOWN
U3 = CMP_TPS3700DDCR: CMP - Comparator Window Open Drain - TSOT-23-6; Manufacturer #1: Texas Instruments; Voltage Rating: 1.8V ~ 18V; Current Rating: 40mA; GRAMS Lib Spec: 2.8; Polarized: YES; Value: *; Tolerance: *; Power Max: *; HelpURL: https://www.ti.com/lit/ds/symlink/tps3700.pdf?ts=1613994469122&ref_url=https%253A%252F%252Fwww.ti.com%252Fproduct%252FTPS3700%253Futm_source%253Dgoogle%2526utm_medium%253Dcpc%2526utm_campaign%253Dapp-null-null-GPN_EN-cpc-pf-google-wwe%2526utm_content%253DTPS3700%2526ds_k%253DTPS3700%2526DCM%253Dyes%2526gclid%253DEAIaIQobChMI6PCR77X97gIVzUeRBR1hwwWTEAAYASAAEgJJbfD_BwE%2526gclsrc%253Daw.ds; CreatedBy/Date: Louis-Daniel Gaulin / 22-02-2021; VerifiedBy: Hubert Dube - 26/02/2021; Temperature: -40°C ~ 125°C; Package: TSOT-23-6; Manufacturer #2: *; Note: *; Assembly Type: SMT; Part Number #2: *; Part Number #1: TPS3700DDCR; Magnetic Material: *; Supplier 1: Digi-Key; Supplier Part Number 1: 296-30395-2-ND
U4 = ADC_MCP3021A5T-E/OT: ADC - IC ADC 10BIT I2C 22.3KSPS - SOT-23-5; Manufacturer #1: Microchip Technology; Note: Slave I2C Adress = 1001101; Value: 10 bit, 1 Channels, 22.3ksps; Voltage rating: 2.7V ~ 5.5V; Polarized: Yes; Magnetic Material: UNKNOWN; GRAMS Lib Spec: 2.8; Current Rating: *; Manufacturer #2: *; Power Max: *; Part Number #1: MCP3021A5T-E/OT; Part Number #2: *; HelpURL: https://ww1.microchip.com/downloads/en/DeviceDoc/20001805C.pdf; Supplier 1: Digi-Key; Supplier Part Number 1: MCP3021A5T-E/OTCT-ND; Assembly Type: SMD; Temperature: -40°C~125°C; Package: SOT-23-5; CreatedBy/Date: Louis-Daniel Gaulin / 24-02-2021; Tolerance: *; VerifiedBy: Hubert Dube - 26/02/2021; Cryo: UNKNOWN